# Altium project Smart_Switch.PrjPcb
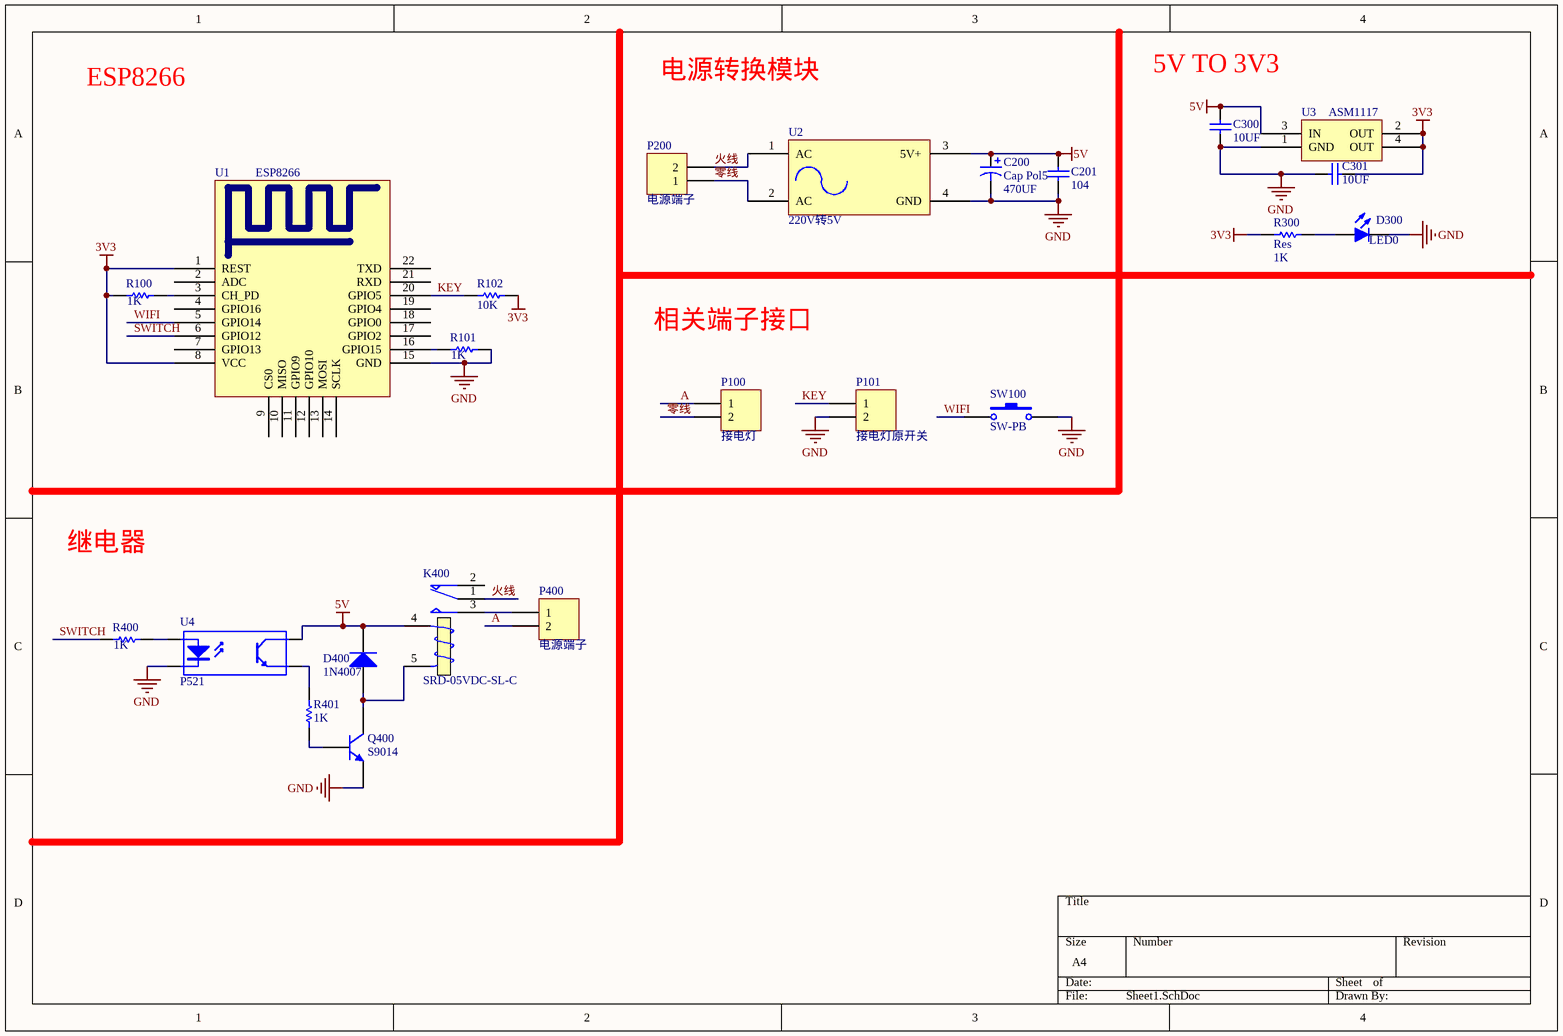
[diagram p0: Sheet1.SchDoc]
1 sheet, 23 parts. Net scope: global (net labels, ports and power ports of the same name join across sheets).

## Sheet Sheet1.SchDoc
size A4

### Parts
C200  Cap Pol5  Vaule: 470UF  [SMD8*10.5]
C201  104  [Cap0805]
C300  10UF  [Cap0805]
C301  10UF  [Cap0805]
D300  LED0  [LED-0805]
D400  1N4007  [DO-214AA]
K400  SRD-05VDC-SL-C  [MODULE5B]
P100  接电灯  [HDR1X2]
P101  接电灯原开关  [HDR1X2]
P200  电源端子  [HDR1X2]
P400  电源端子  [HDR1X2]
Q400  S9014  [TO-226-AA]
R100  Vaule: 1K  [0805]  (hidden comment: Res)
R101  Vaule: 1K  [0805]  (hidden comment: Res)
R102  Vaule: 10K  [0805]  (hidden comment: Res)
R300  Res  Vaule: 1K  [0805]
R400  Vaule: 1K  [0805]  (hidden comment: Res)
R401  Vaule: 1K  [0805]  (hidden comment: Res)
SW100  SW-PB  [SW-PB]
U1  ESP8266  [ESP8266]
U2  220V转5V
U3  ASM1117  [SOT-223]
U4  P521  [DIP-4]

### Nets
3V3: C301.1 R100.1 R102.2 R300.1 U1.1(REST) U1.8(VCC) U3.2(OUT) U3.4(OUT)
5V: C200.1 C201.1 C300.2 D400.2(K) K400.4(T1) U2.3(5V+) U3.3(IN) U4.4(C)
GND: C200.2 C201.2 C300.1 C301.2 D300.2(K) P101.2 Q400.3(E) R101.2 SW100.2 U1.15(GND) U2.4(GND) U3.1(GND) U4.2(K)
A: P100.1 P400.2
KEY: P101.1 R102.1 U1.20(GPIO5)
SWITCH: R400.1 U1.6(GPIO12)
WIFI: SW100.1 U1.5(GPIO14)
火线: K400.1(COM) P200.2 U2.1(AC)
零线: P100.2 P200.1 U2.2(AC)
NetD300_1: D300.1(A) R300.2
NetD400_1: D400.1(A) K400.5(T2) Q400.1(C)
NetK400_3: K400.3(NO) P400.1
NetQ400_2: Q400.2(B) R401.1
NetR100_2: R100.2 U1.3(CH_PD)
NetR101_1: R101.1 U1.16(GPIO15)
NetR400_2: R400.2 U4.1(A)
NetR401_2: R401.2 U4.3(E)

Not connected (* = marked no-connect by the designer): K400 2(NC); U1 2(ADC) 4(GPIO16) 7(GPIO13) 9(CS0) 10(MISO) 11(GPIO9) 12(GPIO10) 13(MOSI) 14(SCLK) 17(GPIO2) 18(GPIO0) 19(GPIO4) 21(RXD) 22(TXD)

### Notes on the sheet
- ESP8266
- 电源转换模块
- 5V TO 3V3
- 相关端子接口
- 继电器

### Library data of the parts
C200 = Cap Pol5: 220UF电解电容
C201 C300 C301 = Cap: 0805贴片电容
D300 = LED0: 0805贴片LED灯
D400 = Doide: 肖特基二极管
K400 = Relay: SPDT Relay; Published: 8-Jun-2000; LatestRevisionDate: 17-Jul-2002; LatestRevisionNote: Re-released for DXP Platform.; PackageReference: MODULE5B; Publisher: Altium Limited
P100 P101 P200 P400 = Header 2: Header, 2-Pin; LatestRevisionDate: 17-Jul-2002; LatestRevisionNote: Re-released for DXP Platform.; Publisher: Altium Limited
Q400 = NPN: NPN Bipolar Transistor; Published: 8-Jun-2000; LatestRevisionDate: 17-Jul-2002; LatestRevisionNote: Re-released for DXP Platform.; PackageReference: TO-226-AA; Publisher: Altium Limited; PackageDescription: TO, Flat Index; 3 In-Line, Axial Leads; Body Dia. 4.8mm; Leads 0.55 x 0.51 mm (max); Code_JEDEC: TO-226-AA
R100-R102 R300 R400 R401 = Res: 0805贴片电阻
SW100 = SW-PB: 贴片按键
U1 = ESP8266: 串口wifi模块
U2 = 电源转换
U3 = ASM1117: 线性稳压芯片
U4 = Optoisolator1: 4-Pin Phototransistor Optocoupler; Published: 24-Mar-1999; LatestRevisionDate: 04-Mar-2005; LatestRevisionNote: Sch pins 3 & 4 Swapped.; DatasheetVersion: Nov-2003; PackageReference: DIP-4; Publisher: Altium Limited